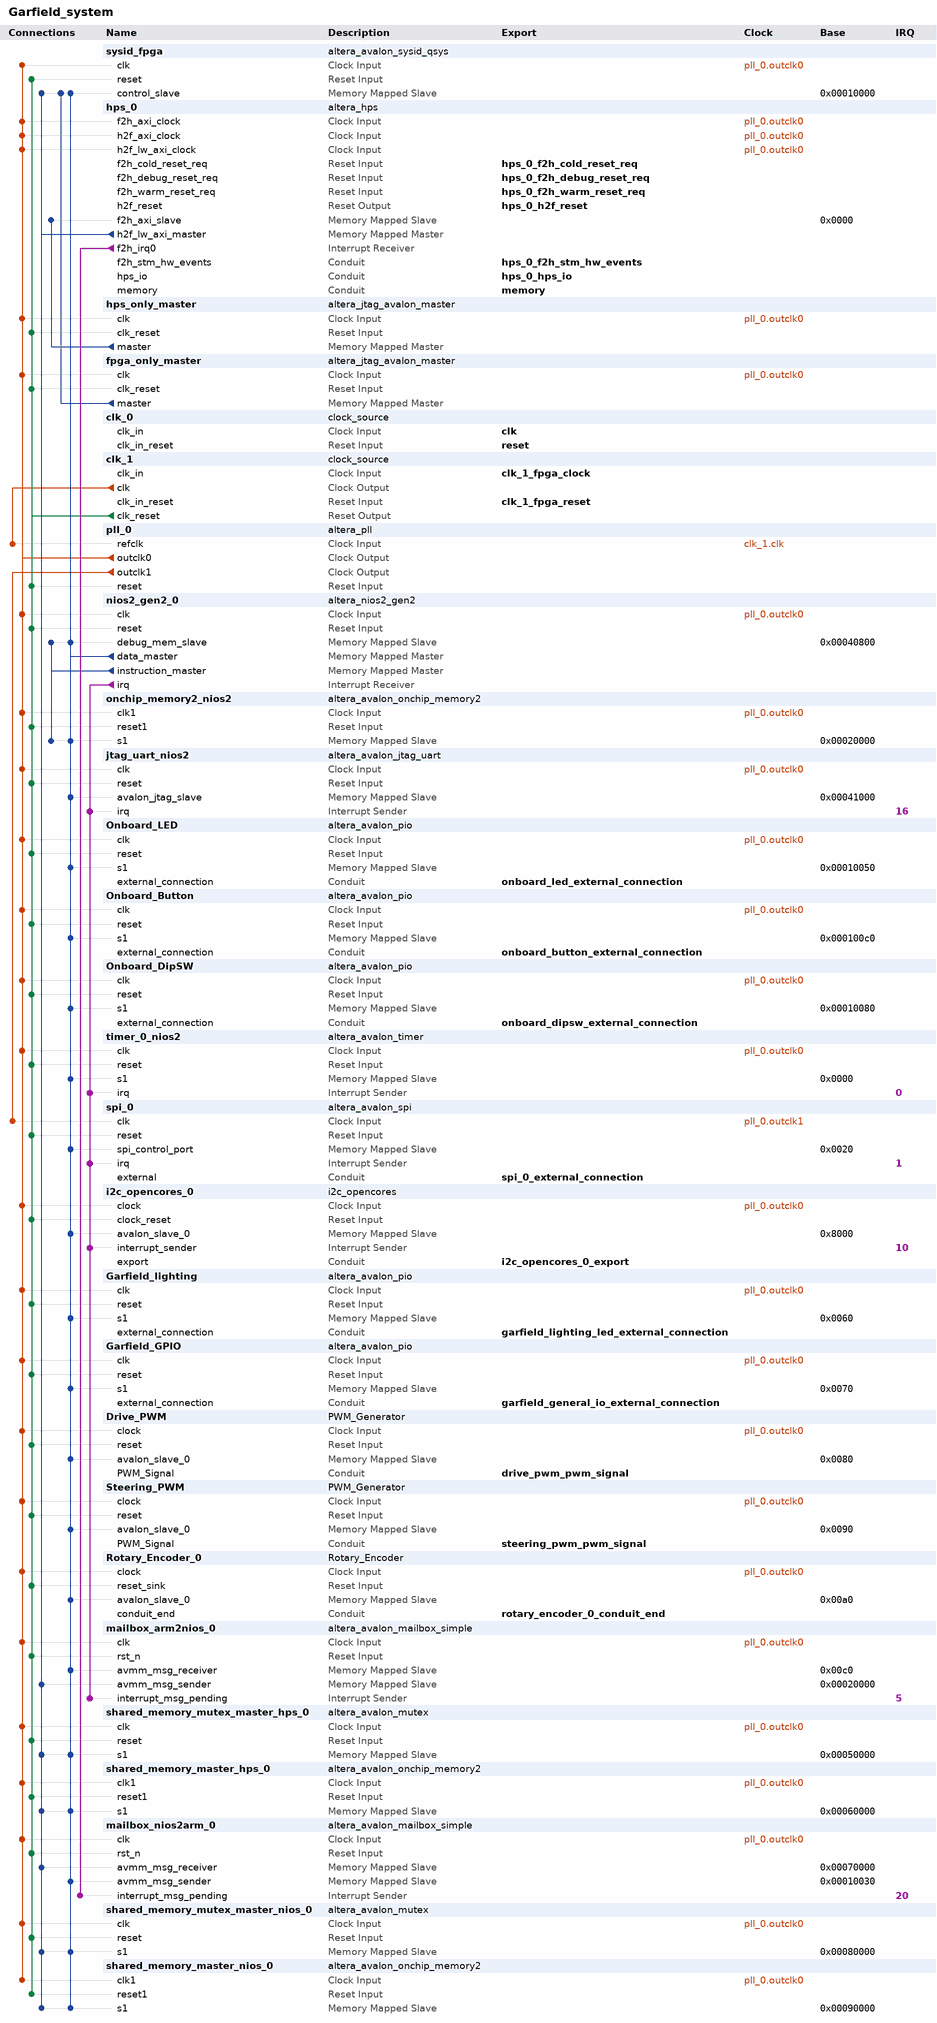
[diagram p0: system contents]
# Platform Designer (Qsys) system Garfield_system, Cyclone V 5CSEMA4U23C6
# Parameters at their usual value, and those the tool derives, are not listed.
package require -exact qsys 16.1
create_system Garfield_system
set_project_property DEVICE_FAMILY {Cyclone V}
set_project_property DEVICE 5CSEMA4U23C6

add_instance sysid_fpga altera_avalon_sysid_qsys 16.1
set_instance_parameter_value sysid_fpga id 50536471

add_instance hps_0 altera_hps 16.1
set_instance_parameter_value hps_0 EMAC1_Mode RGMII
set_instance_parameter_value hps_0 EMAC1_PinMuxing {HPS I/O Set 0}
set_instance_parameter_value hps_0 F2SCLK_COLDRST_Enable true
set_instance_parameter_value hps_0 F2SCLK_DBGRST_Enable true
set_instance_parameter_value hps_0 F2SCLK_WARMRST_Enable true
set_instance_parameter_value hps_0 F2SINTERRUPT_Enable true
set_instance_parameter_value hps_0 F2S_Width 2
set_instance_parameter_value hps_0 FPGA_PERIPHERAL_OUTPUT_CLOCK_FREQ_EMAC0_GTX_CLK 100
set_instance_parameter_value hps_0 FPGA_PERIPHERAL_OUTPUT_CLOCK_FREQ_EMAC0_MD_CLK 100.0
set_instance_parameter_value hps_0 FPGA_PERIPHERAL_OUTPUT_CLOCK_FREQ_EMAC1_GTX_CLK 100
set_instance_parameter_value hps_0 FPGA_PERIPHERAL_OUTPUT_CLOCK_FREQ_EMAC1_MD_CLK 100.0
set_instance_parameter_value hps_0 HPS_PROTOCOL DDR3
set_instance_parameter_value hps_0 I2C0_Mode I2C
set_instance_parameter_value hps_0 I2C0_PinMuxing {HPS I/O Set 0}
set_instance_parameter_value hps_0 I2C1_Mode I2C
set_instance_parameter_value hps_0 I2C1_PinMuxing {HPS I/O Set 0}
set_instance_parameter_value hps_0 LWH2F_Enable true
set_instance_parameter_value hps_0 MEM_BANKADDR_WIDTH 3
set_instance_parameter_value hps_0 MEM_CLK_FREQ 400.0
set_instance_parameter_value hps_0 MEM_COL_ADDR_WIDTH 10
set_instance_parameter_value hps_0 MEM_DQ_WIDTH 32
set_instance_parameter_value hps_0 MEM_DRV_STR RZQ/6
set_instance_parameter_value hps_0 MEM_ROW_ADDR_WIDTH 15
set_instance_parameter_value hps_0 MEM_RTT_NOM RZQ/6
set_instance_parameter_value hps_0 MEM_RTT_WR {Dynamic ODT off}
set_instance_parameter_value hps_0 MEM_TCL 7
set_instance_parameter_value hps_0 MEM_TFAW_NS 37.5
set_instance_parameter_value hps_0 MEM_TRAS_NS 35.0
set_instance_parameter_value hps_0 MEM_TRCD_NS 13.75
set_instance_parameter_value hps_0 MEM_TRFC_NS 300.0
set_instance_parameter_value hps_0 MEM_TRP_NS 13.75
set_instance_parameter_value hps_0 MEM_VENDOR Other
set_instance_parameter_value hps_0 MEM_WTCL 7
set_instance_parameter_value hps_0 QSPI_Mode N/A
set_instance_parameter_value hps_0 QSPI_PinMuxing Unused
set_instance_parameter_value hps_0 REF_CLK_FREQ 25.0
set_instance_parameter_value hps_0 S2FCLK_USER2CLK 5
set_instance_parameter_value hps_0 S2F_Width 2
set_instance_parameter_value hps_0 SDIO_Mode {4-bit Data}
set_instance_parameter_value hps_0 SDIO_PinMuxing {HPS I/O Set 0}
set_instance_parameter_value hps_0 SPIM1_Mode {Single Slave Select}
set_instance_parameter_value hps_0 SPIM1_PinMuxing {HPS I/O Set 0}
set_instance_parameter_value hps_0 STM_Enable true
set_instance_parameter_value hps_0 TIMING_BOARD_AC_SKEW 0.02
set_instance_parameter_value hps_0 TIMING_BOARD_AC_TO_CK_SKEW 0.0
set_instance_parameter_value hps_0 TIMING_BOARD_DQ_TO_DQS_SKEW 0.0
set_instance_parameter_value hps_0 TIMING_BOARD_MAX_CK_DELAY 0.6
set_instance_parameter_value hps_0 TIMING_BOARD_MAX_DQS_DELAY 0.6
set_instance_parameter_value hps_0 TIMING_BOARD_SKEW_BETWEEN_DQS 0.02
set_instance_parameter_value hps_0 TIMING_BOARD_SKEW_CKDQS_DIMM_MAX 0.01
set_instance_parameter_value hps_0 TIMING_BOARD_SKEW_CKDQS_DIMM_MIN -0.01
set_instance_parameter_value hps_0 TIMING_BOARD_SKEW_WITHIN_DQS 0.02
set_instance_parameter_value hps_0 TIMING_TDH 125
set_instance_parameter_value hps_0 TIMING_TDQSCK 400
set_instance_parameter_value hps_0 TIMING_TDQSQ 120
set_instance_parameter_value hps_0 TIMING_TDS 50
set_instance_parameter_value hps_0 TIMING_TIH 250
set_instance_parameter_value hps_0 TIMING_TIS 175
set_instance_parameter_value hps_0 TIMING_TQSH 0.38
set_instance_parameter_value hps_0 UART0_Mode {No Flow Control}
set_instance_parameter_value hps_0 UART0_PinMuxing {HPS I/O Set 0}
set_instance_parameter_value hps_0 USB1_Mode SDR
set_instance_parameter_value hps_0 USB1_PinMuxing {HPS I/O Set 0}
set_instance_parameter_value hps_0 desired_cfg_clk_mhz 100.0
set_instance_parameter_value hps_0 desired_qspi_clk_mhz 370.0

add_instance hps_only_master altera_jtag_avalon_master 16.1

add_instance fpga_only_master altera_jtag_avalon_master 16.1

add_instance clk_0 clock_source 16.1
set_instance_parameter_value clk_0 clockFrequency 50000000

add_instance clk_1 clock_source 16.1
set_instance_parameter_value clk_1 clockFrequency 50000000

add_instance pll_0 altera_pll 16.1
set_instance_parameter_value pll_0 gui_device_speed_grade 1
set_instance_parameter_value pll_0 gui_number_of_clocks 2
set_instance_parameter_value pll_0 gui_operation_mode direct
set_instance_parameter_value pll_0 gui_output_clock_frequency0 50.0
set_instance_parameter_value pll_0 gui_output_clock_frequency1 48.0
set_instance_parameter_value pll_0 gui_pll_mode {Integer-N PLL}
set_instance_parameter_value pll_0 gui_reference_clock_frequency 50.0
set_instance_parameter_value pll_0 gui_use_locked true

add_instance nios2_gen2_0 altera_nios2_gen2 16.1
set_instance_parameter_value nios2_gen2_0 cpuID 3
set_instance_parameter_value nios2_gen2_0 dcache_size 0
set_instance_parameter_value nios2_gen2_0 exceptionSlave onchip_memory2_nios2.s1
set_instance_parameter_value nios2_gen2_0 icache_size 0
set_instance_parameter_value nios2_gen2_0 impl Fast
set_instance_parameter_value nios2_gen2_0 resetSlave onchip_memory2_nios2.s1

add_instance onchip_memory2_nios2 altera_avalon_onchip_memory2 16.1
set_instance_parameter_value onchip_memory2_nios2 dataWidth 32
set_instance_parameter_value onchip_memory2_nios2 dualPort false
set_instance_parameter_value onchip_memory2_nios2 initMemContent true
set_instance_parameter_value onchip_memory2_nios2 initializationFileName onchip_mem.hex
set_instance_parameter_value onchip_memory2_nios2 memorySize 131072

add_instance jtag_uart_nios2 altera_avalon_jtag_uart 16.1
set_instance_parameter_value jtag_uart_nios2 simInteractiveOptions NO_INTERACTIVE_WINDOWS

add_instance Onboard_LED altera_avalon_pio 16.1
set_instance_parameter_value Onboard_LED direction Output
set_instance_parameter_value Onboard_LED width 8

add_instance Onboard_Button altera_avalon_pio 16.1
set_instance_parameter_value Onboard_Button bitClearingEdgeCapReg true
set_instance_parameter_value Onboard_Button captureEdge true
set_instance_parameter_value Onboard_Button direction Input
set_instance_parameter_value Onboard_Button edgeType FALLING
set_instance_parameter_value Onboard_Button irqType EDGE
set_instance_parameter_value Onboard_Button width 2

add_instance Onboard_DipSW altera_avalon_pio 16.1
set_instance_parameter_value Onboard_DipSW bitClearingEdgeCapReg true
set_instance_parameter_value Onboard_DipSW captureEdge true
set_instance_parameter_value Onboard_DipSW direction Input
set_instance_parameter_value Onboard_DipSW edgeType ANY
set_instance_parameter_value Onboard_DipSW irqType EDGE
set_instance_parameter_value Onboard_DipSW width 4

add_instance timer_0_nios2 altera_avalon_timer 16.1
set_instance_parameter_value timer_0_nios2 alwaysRun true
set_instance_parameter_value timer_0_nios2 fixedPeriod true
set_instance_parameter_value timer_0_nios2 period 1
set_instance_parameter_value timer_0_nios2 periodUnits MSEC

add_instance spi_0 altera_avalon_spi 16.1
set_instance_parameter_value spi_0 clockPolarity 0
set_instance_parameter_value spi_0 dataWidth 8
set_instance_parameter_value spi_0 masterSPI true
set_instance_parameter_value spi_0 numberOfSlaves 3
set_instance_parameter_value spi_0 targetClockRate 24000000

add_instance i2c_opencores_0 i2c_opencores 13.0

add_instance Garfield_lighting altera_avalon_pio 16.1
set_instance_parameter_value Garfield_lighting direction Output
set_instance_parameter_value Garfield_lighting width 4

add_instance Garfield_GPIO altera_avalon_pio 16.1
set_instance_parameter_value Garfield_GPIO direction Output
set_instance_parameter_value Garfield_GPIO width 8

add_instance Drive_PWM PWM_Generator 1.0
set_instance_parameter_value Drive_PWM datawidth 32
set_instance_parameter_value Drive_PWM freq_core 50000000
set_instance_parameter_value Drive_PWM freq_pwm 2000

add_instance Steering_PWM PWM_Generator 1.0
set_instance_parameter_value Steering_PWM datawidth 32
set_instance_parameter_value Steering_PWM freq_core 50000000
set_instance_parameter_value Steering_PWM freq_pwm 125

add_instance Rotary_Encoder_0 Rotary_Encoder 1.0
set_instance_parameter_value Rotary_Encoder_0 datawidth 32

add_instance mailbox_arm2nios_0 altera_avalon_mailbox_simple 16.1
set_instance_parameter_value mailbox_arm2nios_0 AWIDTH 2
set_instance_parameter_value mailbox_arm2nios_0 DWIDTH 32
set_instance_parameter_value mailbox_arm2nios_0 MSG_ARRIVAL_NOTIFY 1
set_instance_parameter_value mailbox_arm2nios_0 MSG_SPACE_NOTIFY 0

add_instance shared_memory_mutex_master_hps_0 altera_avalon_mutex 16.1
set_instance_parameter_value shared_memory_mutex_master_hps_0 initialOwner 1
set_instance_parameter_value shared_memory_mutex_master_hps_0 initialValue 1

add_instance shared_memory_master_hps_0 altera_avalon_onchip_memory2 16.1
set_instance_parameter_value shared_memory_master_hps_0 dataWidth 32
set_instance_parameter_value shared_memory_master_hps_0 dualPort false
set_instance_parameter_value shared_memory_master_hps_0 initMemContent true
set_instance_parameter_value shared_memory_master_hps_0 initializationFileName onchip_mem.hex
set_instance_parameter_value shared_memory_master_hps_0 memorySize 2048

add_instance mailbox_nios2arm_0 altera_avalon_mailbox_simple 16.1
set_instance_parameter_value mailbox_nios2arm_0 AWIDTH 2
set_instance_parameter_value mailbox_nios2arm_0 DWIDTH 32
set_instance_parameter_value mailbox_nios2arm_0 MSG_ARRIVAL_NOTIFY 1
set_instance_parameter_value mailbox_nios2arm_0 MSG_SPACE_NOTIFY 0

add_instance shared_memory_mutex_master_nios_0 altera_avalon_mutex 16.1
set_instance_parameter_value shared_memory_mutex_master_nios_0 initialOwner 3
set_instance_parameter_value shared_memory_mutex_master_nios_0 initialValue 1

add_instance shared_memory_master_nios_0 altera_avalon_onchip_memory2 16.1
set_instance_parameter_value shared_memory_master_nios_0 dataWidth 32
set_instance_parameter_value shared_memory_master_nios_0 dualPort false
set_instance_parameter_value shared_memory_master_nios_0 initMemContent true
set_instance_parameter_value shared_memory_master_nios_0 initializationFileName onchip_mem.hex
set_instance_parameter_value shared_memory_master_nios_0 memorySize 2048

# connections
add_connection clk_1.clk pll_0.refclk clock
add_connection pll_0.outclk0 Drive_PWM.clock clock
add_connection pll_0.outclk0 fpga_only_master.clk clock
add_connection pll_0.outclk0 Garfield_GPIO.clk clock
add_connection pll_0.outclk0 Garfield_lighting.clk clock
add_connection pll_0.outclk0 hps_0.f2h_axi_clock clock
add_connection pll_0.outclk0 hps_0.h2f_axi_clock clock
add_connection pll_0.outclk0 hps_0.h2f_lw_axi_clock clock
add_connection pll_0.outclk0 hps_only_master.clk clock
add_connection pll_0.outclk0 i2c_opencores_0.clock clock
add_connection pll_0.outclk0 jtag_uart_nios2.clk clock
add_connection pll_0.outclk0 mailbox_arm2nios_0.clk clock
add_connection pll_0.outclk0 mailbox_nios2arm_0.clk clock
add_connection pll_0.outclk0 nios2_gen2_0.clk clock
add_connection pll_0.outclk0 Onboard_Button.clk clock
add_connection pll_0.outclk0 Onboard_DipSW.clk clock
add_connection pll_0.outclk0 Onboard_LED.clk clock
add_connection pll_0.outclk0 onchip_memory2_nios2.clk1 clock
add_connection pll_0.outclk0 Rotary_Encoder_0.clock clock
add_connection pll_0.outclk0 shared_memory_master_hps_0.clk1 clock
add_connection pll_0.outclk0 shared_memory_master_nios_0.clk1 clock
add_connection pll_0.outclk0 shared_memory_mutex_master_hps_0.clk clock
add_connection pll_0.outclk0 shared_memory_mutex_master_nios_0.clk clock
add_connection pll_0.outclk0 Steering_PWM.clock clock
add_connection pll_0.outclk0 sysid_fpga.clk clock
add_connection pll_0.outclk0 timer_0_nios2.clk clock
add_connection pll_0.outclk1 spi_0.clk clock
add_connection clk_1.clk_reset Drive_PWM.reset reset
add_connection clk_1.clk_reset fpga_only_master.clk_reset reset
add_connection clk_1.clk_reset Garfield_GPIO.reset reset
add_connection clk_1.clk_reset Garfield_lighting.reset reset
add_connection clk_1.clk_reset hps_only_master.clk_reset reset
add_connection clk_1.clk_reset i2c_opencores_0.clock_reset reset
add_connection clk_1.clk_reset jtag_uart_nios2.reset reset
add_connection clk_1.clk_reset mailbox_arm2nios_0.rst_n reset
add_connection clk_1.clk_reset mailbox_nios2arm_0.rst_n reset
add_connection clk_1.clk_reset nios2_gen2_0.reset reset
add_connection clk_1.clk_reset Onboard_Button.reset reset
add_connection clk_1.clk_reset Onboard_DipSW.reset reset
add_connection clk_1.clk_reset Onboard_LED.reset reset
add_connection clk_1.clk_reset onchip_memory2_nios2.reset1 reset
add_connection clk_1.clk_reset pll_0.reset reset
add_connection clk_1.clk_reset Rotary_Encoder_0.reset_sink reset
add_connection clk_1.clk_reset shared_memory_master_hps_0.reset1 reset
add_connection clk_1.clk_reset shared_memory_master_nios_0.reset1 reset
add_connection clk_1.clk_reset shared_memory_mutex_master_hps_0.reset reset
add_connection clk_1.clk_reset shared_memory_mutex_master_nios_0.reset reset
add_connection clk_1.clk_reset spi_0.reset reset
add_connection clk_1.clk_reset Steering_PWM.reset reset
add_connection clk_1.clk_reset sysid_fpga.reset reset
add_connection clk_1.clk_reset timer_0_nios2.reset reset
add_connection fpga_only_master.master sysid_fpga.control_slave avalon
set_connection_parameter_value fpga_only_master.master/sysid_fpga.control_slave baseAddress 0x00010000
add_connection hps_0.h2f_lw_axi_master mailbox_arm2nios_0.avmm_msg_sender avalon
set_connection_parameter_value hps_0.h2f_lw_axi_master/mailbox_arm2nios_0.avmm_msg_sender baseAddress 0x00020000
add_connection hps_0.h2f_lw_axi_master mailbox_nios2arm_0.avmm_msg_receiver avalon
set_connection_parameter_value hps_0.h2f_lw_axi_master/mailbox_nios2arm_0.avmm_msg_receiver baseAddress 0x00070000
add_connection hps_0.h2f_lw_axi_master shared_memory_master_hps_0.s1 avalon
set_connection_parameter_value hps_0.h2f_lw_axi_master/shared_memory_master_hps_0.s1 baseAddress 0x00060000
add_connection hps_0.h2f_lw_axi_master shared_memory_master_nios_0.s1 avalon
set_connection_parameter_value hps_0.h2f_lw_axi_master/shared_memory_master_nios_0.s1 baseAddress 0x00090000
add_connection hps_0.h2f_lw_axi_master shared_memory_mutex_master_hps_0.s1 avalon
set_connection_parameter_value hps_0.h2f_lw_axi_master/shared_memory_mutex_master_hps_0.s1 baseAddress 0x00050000
add_connection hps_0.h2f_lw_axi_master shared_memory_mutex_master_nios_0.s1 avalon
set_connection_parameter_value hps_0.h2f_lw_axi_master/shared_memory_mutex_master_nios_0.s1 baseAddress 0x00080000
add_connection hps_0.h2f_lw_axi_master sysid_fpga.control_slave avalon
set_connection_parameter_value hps_0.h2f_lw_axi_master/sysid_fpga.control_slave baseAddress 0x00010000
add_connection hps_only_master.master hps_0.f2h_axi_slave avalon
set_connection_parameter_value hps_only_master.master/hps_0.f2h_axi_slave baseAddress 0x0000
add_connection nios2_gen2_0.data_master Drive_PWM.avalon_slave_0 avalon
set_connection_parameter_value nios2_gen2_0.data_master/Drive_PWM.avalon_slave_0 baseAddress 0x0080
add_connection nios2_gen2_0.data_master Garfield_GPIO.s1 avalon
set_connection_parameter_value nios2_gen2_0.data_master/Garfield_GPIO.s1 baseAddress 0x0070
add_connection nios2_gen2_0.data_master Garfield_lighting.s1 avalon
set_connection_parameter_value nios2_gen2_0.data_master/Garfield_lighting.s1 baseAddress 0x0060
add_connection nios2_gen2_0.data_master i2c_opencores_0.avalon_slave_0 avalon
set_connection_parameter_value nios2_gen2_0.data_master/i2c_opencores_0.avalon_slave_0 baseAddress 0x8000
add_connection nios2_gen2_0.data_master jtag_uart_nios2.avalon_jtag_slave avalon
set_connection_parameter_value nios2_gen2_0.data_master/jtag_uart_nios2.avalon_jtag_slave baseAddress 0x00041000
add_connection nios2_gen2_0.data_master mailbox_arm2nios_0.avmm_msg_receiver avalon
set_connection_parameter_value nios2_gen2_0.data_master/mailbox_arm2nios_0.avmm_msg_receiver baseAddress 0x00c0
add_connection nios2_gen2_0.data_master mailbox_nios2arm_0.avmm_msg_sender avalon
set_connection_parameter_value nios2_gen2_0.data_master/mailbox_nios2arm_0.avmm_msg_sender baseAddress 0x00010030
add_connection nios2_gen2_0.data_master nios2_gen2_0.debug_mem_slave avalon
set_connection_parameter_value nios2_gen2_0.data_master/nios2_gen2_0.debug_mem_slave baseAddress 0x00040800
add_connection nios2_gen2_0.data_master Onboard_Button.s1 avalon
set_connection_parameter_value nios2_gen2_0.data_master/Onboard_Button.s1 baseAddress 0x000100c0
add_connection nios2_gen2_0.data_master Onboard_DipSW.s1 avalon
set_connection_parameter_value nios2_gen2_0.data_master/Onboard_DipSW.s1 baseAddress 0x00010080
add_connection nios2_gen2_0.data_master Onboard_LED.s1 avalon
set_connection_parameter_value nios2_gen2_0.data_master/Onboard_LED.s1 baseAddress 0x00010050
add_connection nios2_gen2_0.data_master onchip_memory2_nios2.s1 avalon
set_connection_parameter_value nios2_gen2_0.data_master/onchip_memory2_nios2.s1 baseAddress 0x00020000
add_connection nios2_gen2_0.data_master Rotary_Encoder_0.avalon_slave_0 avalon
set_connection_parameter_value nios2_gen2_0.data_master/Rotary_Encoder_0.avalon_slave_0 baseAddress 0x00a0
add_connection nios2_gen2_0.data_master shared_memory_master_hps_0.s1 avalon
set_connection_parameter_value nios2_gen2_0.data_master/shared_memory_master_hps_0.s1 baseAddress 0x00060000
add_connection nios2_gen2_0.data_master shared_memory_master_nios_0.s1 avalon
set_connection_parameter_value nios2_gen2_0.data_master/shared_memory_master_nios_0.s1 baseAddress 0x00090000
add_connection nios2_gen2_0.data_master shared_memory_mutex_master_hps_0.s1 avalon
set_connection_parameter_value nios2_gen2_0.data_master/shared_memory_mutex_master_hps_0.s1 baseAddress 0x00050000
add_connection nios2_gen2_0.data_master shared_memory_mutex_master_nios_0.s1 avalon
set_connection_parameter_value nios2_gen2_0.data_master/shared_memory_mutex_master_nios_0.s1 baseAddress 0x00080000
add_connection nios2_gen2_0.data_master spi_0.spi_control_port avalon
set_connection_parameter_value nios2_gen2_0.data_master/spi_0.spi_control_port baseAddress 0x0020
add_connection nios2_gen2_0.data_master Steering_PWM.avalon_slave_0 avalon
set_connection_parameter_value nios2_gen2_0.data_master/Steering_PWM.avalon_slave_0 baseAddress 0x0090
add_connection nios2_gen2_0.data_master sysid_fpga.control_slave avalon
set_connection_parameter_value nios2_gen2_0.data_master/sysid_fpga.control_slave baseAddress 0x00010000
add_connection nios2_gen2_0.data_master timer_0_nios2.s1 avalon
set_connection_parameter_value nios2_gen2_0.data_master/timer_0_nios2.s1 baseAddress 0x0000
add_connection nios2_gen2_0.instruction_master nios2_gen2_0.debug_mem_slave avalon
set_connection_parameter_value nios2_gen2_0.instruction_master/nios2_gen2_0.debug_mem_slave baseAddress 0x00040800
add_connection nios2_gen2_0.instruction_master onchip_memory2_nios2.s1 avalon
set_connection_parameter_value nios2_gen2_0.instruction_master/onchip_memory2_nios2.s1 baseAddress 0x00020000
add_connection hps_0.f2h_irq0 mailbox_nios2arm_0.interrupt_msg_pending interrupt
set_connection_parameter_value hps_0.f2h_irq0/mailbox_nios2arm_0.interrupt_msg_pending irqNumber 20
add_connection nios2_gen2_0.irq i2c_opencores_0.interrupt_sender interrupt
set_connection_parameter_value nios2_gen2_0.irq/i2c_opencores_0.interrupt_sender irqNumber 10
add_connection nios2_gen2_0.irq jtag_uart_nios2.irq interrupt
set_connection_parameter_value nios2_gen2_0.irq/jtag_uart_nios2.irq irqNumber 16
add_connection nios2_gen2_0.irq mailbox_arm2nios_0.interrupt_msg_pending interrupt
set_connection_parameter_value nios2_gen2_0.irq/mailbox_arm2nios_0.interrupt_msg_pending irqNumber 5
add_connection nios2_gen2_0.irq spi_0.irq interrupt
set_connection_parameter_value nios2_gen2_0.irq/spi_0.irq irqNumber 1
add_connection nios2_gen2_0.irq timer_0_nios2.irq interrupt
set_connection_parameter_value nios2_gen2_0.irq/timer_0_nios2.irq irqNumber 0

# exported interfaces
add_interface clk clock sink
set_interface_property clk EXPORT_OF clk_0.clk_in
add_interface clk_1_fpga_clock clock sink
set_interface_property clk_1_fpga_clock EXPORT_OF clk_1.clk_in
add_interface clk_1_fpga_reset reset sink
set_interface_property clk_1_fpga_reset EXPORT_OF clk_1.clk_in_reset
add_interface drive_pwm_pwm_signal conduit end
set_interface_property drive_pwm_pwm_signal EXPORT_OF Drive_PWM.PWM_Signal
add_interface garfield_general_io_external_connection conduit end
set_interface_property garfield_general_io_external_connection EXPORT_OF Garfield_GPIO.external_connection
add_interface garfield_lighting_led_external_connection conduit end
set_interface_property garfield_lighting_led_external_connection EXPORT_OF Garfield_lighting.external_connection
add_interface hps_0_f2h_cold_reset_req reset sink
set_interface_property hps_0_f2h_cold_reset_req EXPORT_OF hps_0.f2h_cold_reset_req
add_interface hps_0_f2h_debug_reset_req reset sink
set_interface_property hps_0_f2h_debug_reset_req EXPORT_OF hps_0.f2h_debug_reset_req
add_interface hps_0_f2h_stm_hw_events conduit end
set_interface_property hps_0_f2h_stm_hw_events EXPORT_OF hps_0.f2h_stm_hw_events
add_interface hps_0_f2h_warm_reset_req reset sink
set_interface_property hps_0_f2h_warm_reset_req EXPORT_OF hps_0.f2h_warm_reset_req
add_interface hps_0_h2f_reset reset source
set_interface_property hps_0_h2f_reset EXPORT_OF hps_0.h2f_reset
add_interface hps_0_hps_io conduit end
set_interface_property hps_0_hps_io EXPORT_OF hps_0.hps_io
add_interface i2c_opencores_0_export conduit end
set_interface_property i2c_opencores_0_export EXPORT_OF i2c_opencores_0.export
add_interface memory conduit end
set_interface_property memory EXPORT_OF hps_0.memory
add_interface onboard_button_external_connection conduit end
set_interface_property onboard_button_external_connection EXPORT_OF Onboard_Button.external_connection
add_interface onboard_dipsw_external_connection conduit end
set_interface_property onboard_dipsw_external_connection EXPORT_OF Onboard_DipSW.external_connection
add_interface onboard_led_external_connection conduit end
set_interface_property onboard_led_external_connection EXPORT_OF Onboard_LED.external_connection
add_interface reset reset sink
set_interface_property reset EXPORT_OF clk_0.clk_in_reset
add_interface rotary_encoder_0_conduit_end conduit end
set_interface_property rotary_encoder_0_conduit_end EXPORT_OF Rotary_Encoder_0.conduit_end
add_interface spi_0_external_connection conduit end
set_interface_property spi_0_external_connection EXPORT_OF spi_0.external
add_interface steering_pwm_pwm_signal conduit end
set_interface_property steering_pwm_pwm_signal EXPORT_OF Steering_PWM.PWM_Signal

set_interconnect_requirement {$system} qsys_mm.clockCrossingAdapter HANDSHAKE
set_interconnect_requirement {$system} qsys_mm.maxAdditionalLatency 1

save_system Garfield_system.qsys
